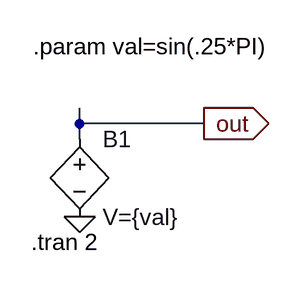
[diagram p0: schematic bv_marker.asc]
bv_marker.asc, the LTspice schematic file:
Version 4
SHEET 1 880 680
WIRE 96 128 96 112
WIRE 224 128 96 128
WIRE 96 144 96 128
FLAG 96 224 0
FLAG 224 128 out
IOPIN 224 128 Out
SYMBOL bv 96 128 R0
SYMATTR InstName B1
SYMATTR Value V={val}
TEXT 48 48 Left 2 !.param val=sin(.25*PI)
TEXT 46 250 Left 2 !.tran 2

The netlist it stands for:
* bv_marker.asc
B1 out 0 V={val}
.param val=sin(.25*PI)
.tran 2
.backanno
.end